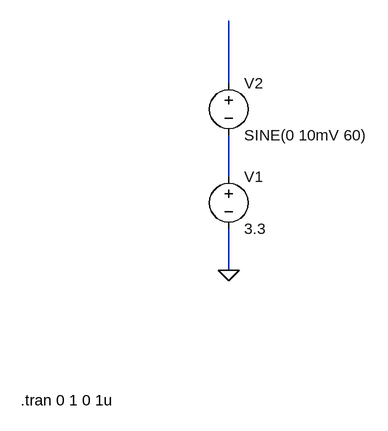
[diagram p0: schematic amp01a.asc]
amp01a.asc, the LTspice schematic file:
Version 4
SHEET 1 1124 732
WIRE -416 32 -416 -64
WIRE -416 176 -416 112
WIRE -416 320 -416 256
FLAG -416 320 0
SYMBOL voltage -416 160 R0
WINDOW 123 0 0 Left 2
WINDOW 39 0 0 Left 2
SYMATTR InstName V1
SYMATTR Value 3.3
SYMBOL voltage -416 16 R0
WINDOW 123 0 0 Left 2
WINDOW 39 0 0 Left 2
SYMATTR InstName V2
SYMATTR Value SINE(0 10mV 60)
TEXT -736 520 Left 2 !.tran 0 1 0 1u

The netlist it stands for:
* amp01a.asc
V1 N002 0 3.3
V2 N001 N002 SINE(0 10mV 60)
.tran 0 1 0 1u
.backanno
.end